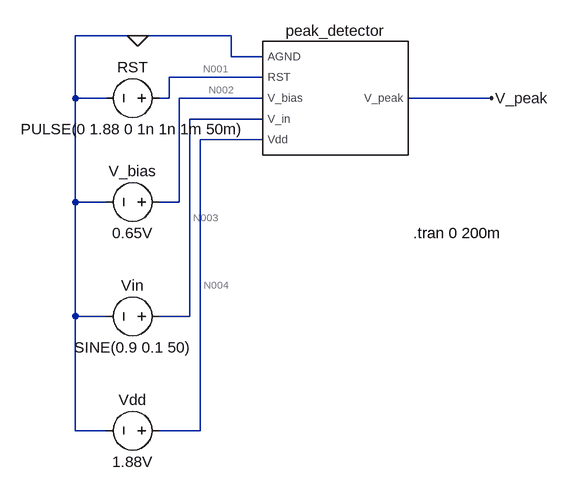
[diagram p0: schematic peak_detector_test.asc]
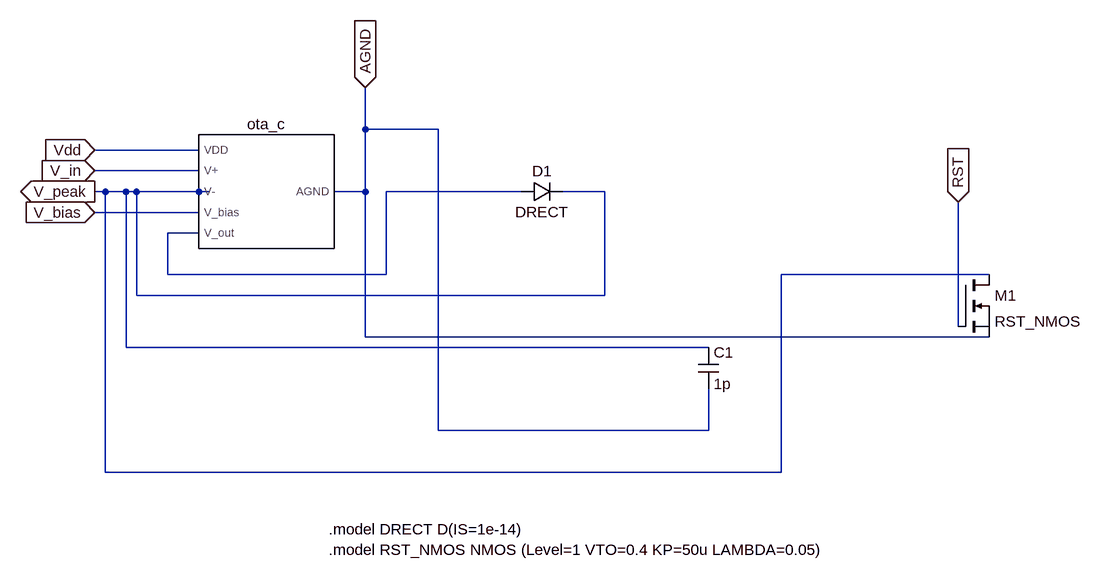
[diagram p1: sub-circuit peak_detector.asc]
peak_detector_test.asc, the LTspice schematic file:
Version 4.1
SHEET 1 880 736
WIRE -64 64 -160 64
WIRE 80 64 -64 64
WIRE 80 96 80 64
WIRE 128 96 80 96
WIRE 128 128 -16 128
WIRE -160 160 -160 64
WIRE -112 160 -160 160
WIRE -16 160 -16 128
WIRE -16 160 -32 160
WIRE 128 160 0 160
WIRE 480 160 352 160
WIRE 128 192 16 192
WIRE 128 224 32 224
WIRE -160 320 -160 160
WIRE -112 320 -160 320
WIRE 0 320 0 160
WIRE 0 320 -32 320
WIRE -160 496 -160 320
WIRE -112 496 -160 496
WIRE 16 496 16 192
WIRE 16 496 -32 496
WIRE -160 672 -160 496
WIRE -112 672 -160 672
WIRE 32 672 32 224
WIRE 32 672 -32 672
FLAG -64 64 0
FLAG 480 160 V_peak
SYMBOL peak_detector 240 160 R0
SYMATTR InstName peak_detector
SYMBOL voltage -16 160 R90
WINDOW 0 -32 56 VBottom 2
WINDOW 3 32 56 VTop 2
WINDOW 123 0 0 Left 0
WINDOW 39 0 0 Left 0
SYMATTR InstName RST
SYMATTR Value PULSE(0 1.88 0 1n 1n 1m 50m)
SYMBOL voltage -16 320 R90
WINDOW 0 -32 56 VBottom 2
WINDOW 3 32 56 VTop 2
SYMATTR InstName V_bias
SYMATTR Value 0.65V
SYMBOL voltage -16 496 R90
WINDOW 0 -32 56 VBottom 2
WINDOW 3 32 56 VTop 2
WINDOW 123 0 0 Left 0
WINDOW 39 0 0 Left 0
SYMATTR InstName Vin
SYMATTR Value SINE(0.9 0.1 50)
SYMBOL voltage -16 672 R90
WINDOW 0 -32 56 VBottom 2
WINDOW 3 32 56 VTop 2
SYMATTR InstName Vdd
SYMATTR Value 1.88V
TEXT 360 368 Left 2 !.tran 0 200m

peak_detector.asc, the sub-circuit schematic file:
Version 4.1
SHEET 1 1388 708
WIRE 288 48 288 -16
WIRE 400 48 288 48
WIRE 32 80 -128 80
WIRE 32 112 -128 112
WIRE -112 144 -128 144
WIRE -80 144 -112 144
WIRE -64 144 -80 144
WIRE 32 144 -64 144
WIRE 48 144 32 144
WIRE 288 144 288 48
WIRE 288 144 240 144
WIRE 528 144 320 144
WIRE 656 144 592 144
WIRE 32 176 -128 176
WIRE 32 208 -16 208
WIRE -16 272 -16 208
WIRE 320 272 320 144
WIRE 320 272 -16 272
WIRE 1248 272 928 272
WIRE -64 304 -64 144
WIRE 656 304 656 144
WIRE 656 304 -64 304
WIRE 1200 352 1200 160
WIRE 288 368 288 144
WIRE 1248 368 288 368
WIRE -80 384 -80 144
WIRE 816 384 -80 384
WIRE 400 512 400 48
WIRE 816 512 816 448
WIRE 816 512 400 512
WIRE -112 576 -112 144
WIRE 928 576 928 272
WIRE 928 576 -112 576
FLAG -128 80 Vdd
IOPIN -128 80 In
FLAG -128 112 V_in
IOPIN -128 112 In
FLAG -128 144 V_peak
IOPIN -128 144 Out
FLAG -128 176 V_bias
IOPIN -128 176 In
FLAG 288 -16 AGND
IOPIN 288 -16 In
FLAG 1200 160 RST
IOPIN 1200 160 In
SYMBOL ota_core 128 144 R0
SYMATTR InstName ota_c
SYMBOL diode 528 160 R270
WINDOW 0 32 32 VTop 2
WINDOW 3 0 32 VBottom 2
SYMATTR InstName D1
SYMATTR Value DRECT
SYMBOL cap 800 384 R0
SYMATTR InstName C1
SYMATTR Value 1p
SYMBOL nmos 1200 272 R0
SYMATTR InstName M1
SYMATTR Value RST_NMOS
TEXT 232 664 Left 2 !.model DRECT D(IS=1e-14)\n.model RST_NMOS NMOS (Level=1 VTO=0.4 KP=50u LAMBDA=0.05)

The netlist it stands for:
* peak_detector_test.asc
X§peak_detector 0 N001 N002 N003 N004 V_peak peak_detector
V§RST N001 0 PULSE(0 1.88 0 1n 1n 1m 50m)
V_bias N002 0 0.65V
Vin N003 0 SINE(0.9 0.1 50)
Vdd N004 0 1.88V

* block symbol definitions
.subckt peak_detector AGND RST V_bias V_in Vdd V_peak
X§ota_c Vdd V_in V_peak V_bias N001 AGND ota_core  ; pins VDD V+ V- V_bias V_out AGND
D1 N001 V_peak DRECT
C1 V_peak AGND 1p
M1 V_peak RST AGND AGND RST_NMOS
.model DRECT D(IS=1e-14)
.model RST_NMOS NMOS (Level=1 VTO=0.4 KP=50u LAMBDA=0.05)
.ends peak_detector

.model D D
.lib standard.dio
.model NMOS NMOS
.model PMOS PMOS
.lib standard.mos
.tran 0 200m
.backanno
.end

* Results of the author's LTspice run, read from the files saved beside the schematic
* Operating Point, zero values left out:
*   V(n002) = 650 mV
*   V(n003) = 900 mV
*   V(n004) = 1.88 V
*   V(v_peak) = 900.5 mV
*   I(Vdd) = -319.9 nA
*   Ix(peak_detector:agnd) = -319.9 nA
*   Ix(peak_detector:vdd) = 319.9 nA
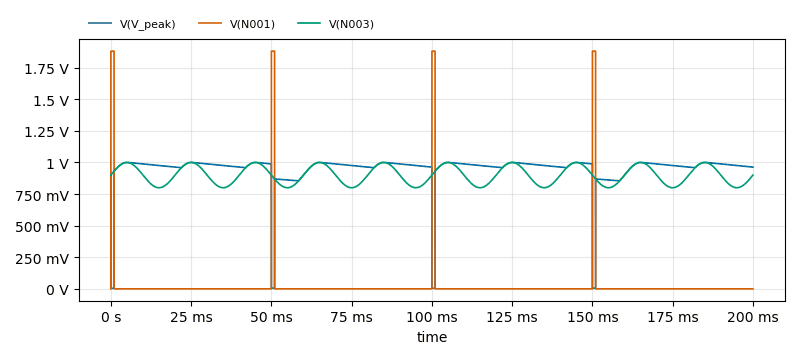
[diagram p2: Transient Analysis of peak_detector_test.asc, plotted from the saved traces]
* Transient Analysis, 1 run:
*   V(V_peak): min 4.53 mV, max 1 V, average 950.5 mV, rms 960.8 mV, last 963.3 mV
*   V(N001): min 0 V, max 1.88 V, average 37.6 mV, rms 265.9 mV, last 0 V
*   V(N003): min 800 mV, max 1 V, average 900 mV, rms 902.8 mV, last 900 mV